# EasyEDA Pro project Main.eprj, board Teensy4.1
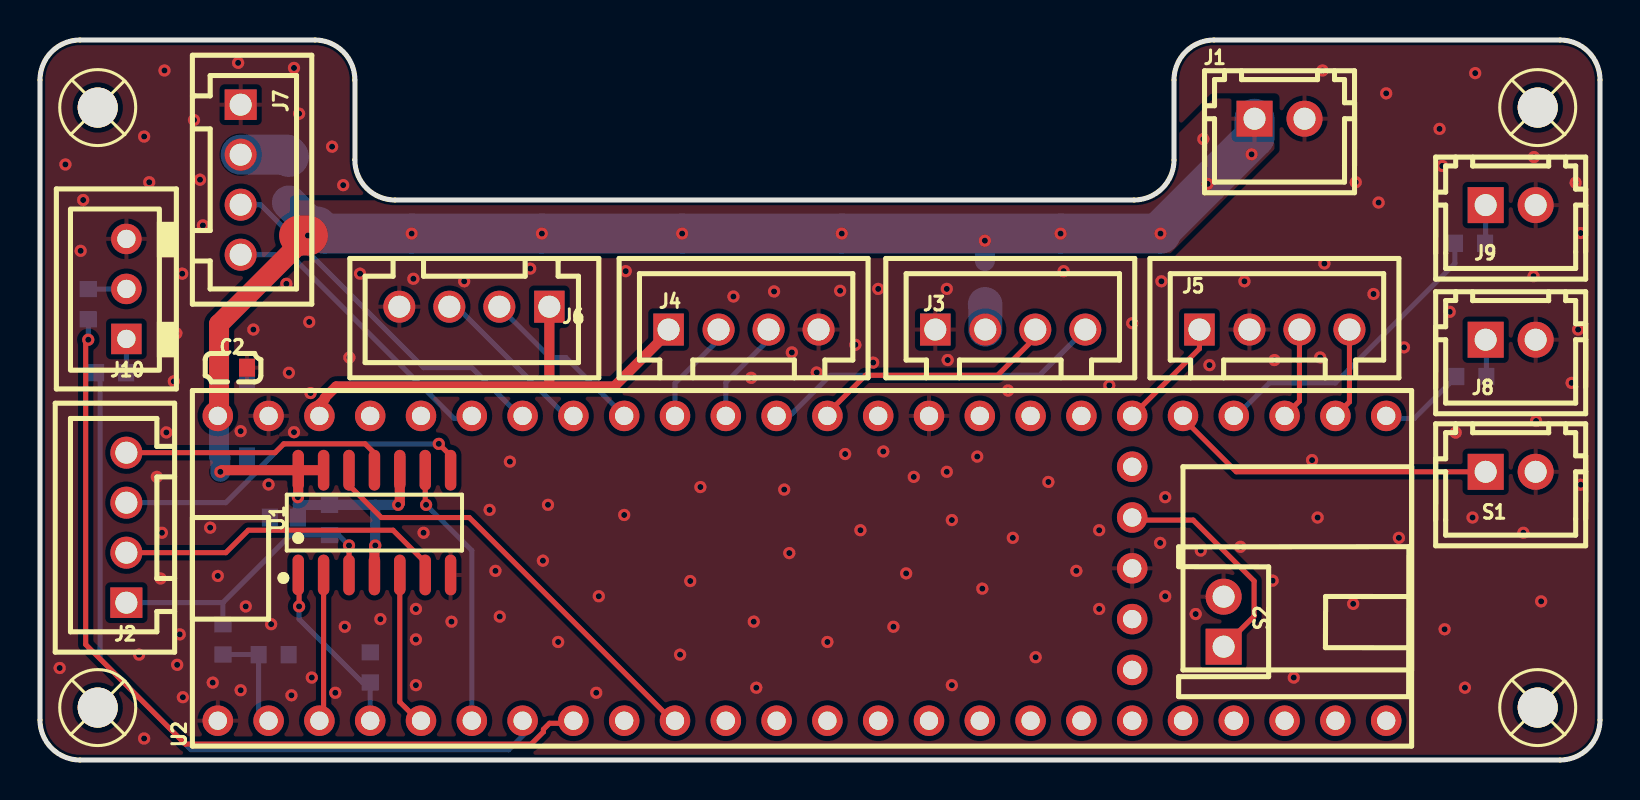
[diagram p9: board, top side]
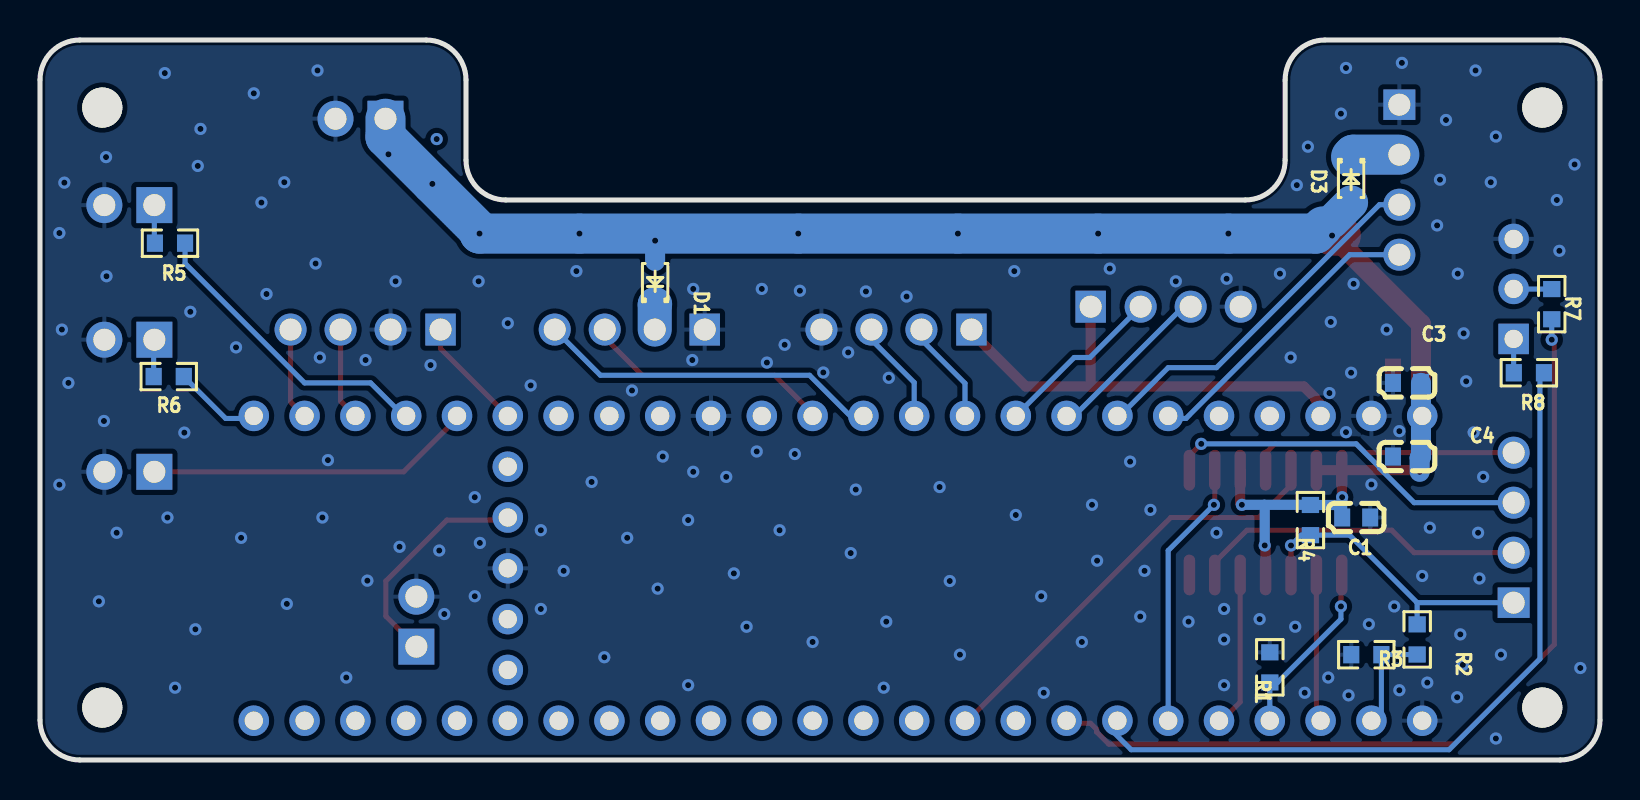
[diagram p10: board, bottom side, seen from below]

Outline 78 x 36 mm; copper layers: Top Layer, Bottom Layer. Coordinates in mm from the lower left corner of the outline.
Outline path: 0,34 0,2 arc(0.59,0.59) 2,0 76,0 arc(77.41,0.59) 78,2 78,34 arc(77.41,35.41) 76,36 58.7,36 arc(57.29,35.41) 56.7,34 56.7,30 arc(56.11,28.59) 54.7,28 17.74,28 arc(16.33,28.59) 15.74,30 15.74,34 arc(15.16,35.41) 13.74,36 2,36 arc(0.59,35.41) 0,34
Stack: Top Layer 0.035mm / Dielectric1 1.51mm FR4 er 4.5 / Bottom Layer 0.035mm

## Design rules (mm)
template: Custom Config
spacing copperThickness1oz (default): track to track 0.102, other pairs 0.152 to 0.3
spacing copperThickness2oz: track to track 0.203, other pairs 0.152 to 0.3
track width copperThickness1oz (default): min 0.127, default 0.254, max 7
track width copperThickness2oz: min 0.203, default 0.254, max 7
differential pair differentialPair (default): width min 0.127, default 0.254, max 2.54; gap min 0.152, default 0.152
via viaSize (default): diameter min 0.5, default 0.61, max 10; hole min 0.3, default 0.305, max 6.3

## Placement (name value [footprint] x y rotation side)
C1  100nF  [C0603]  12.19 12.12 0 bottom
C2  22uF  [C0603]  9.65 19.62 0 top
C3  1uF  [C0603]  9.65 18.86 0 bottom
C4  100nF  [C0603]  9.65 15.17 0 bottom
D1  BAT60B  [SOD-323_L1.7-W1.3-LS2.6-RD-1]  47.24 23.94 90 bottom
D3  BAT60B  [SOD-323_L1.7-W1.3-LS2.6-RD-1]  12.45 29.02 270 bottom
J1  Teensypow  [CONN-TH_2P-P2.50_HX25003-2A]  61.98 32.06 0 top
J2  motSig  [CONN-TH_4P-P2.50_4PIN]  4.32 11.62 90 top
J3  UART3  [CONN-TH_4P-P2.50_4PIN]  48.51 21.52 0 top
J4  I2C0  [CONN-TH_4P-P2.50_4PIN]  35.18 21.52 0 top
J5  UART5 k230  [CONN-TH_4P-P2.50_4PIN]  61.72 21.52 0 top
J6  I2C1  [CONN-TH_4P-P2.50_4PIN]  21.72 22.67 180 top
J7  UART7  [CONN-TH_4P-P2.50_4PIN]  10.03 29.02 270 top
J8  touch0  [CONN-TH_2P-P2.50_HX25003-2A]  73.53 21.01 0 top
J9  touch1  [CONN-TH_2P-P2.50_HX25003-2A]  73.53 27.75 0 top
J10  cnduct  [CONN-TH_3P-P2.50_BX-XH2.54-3PZZ]  4.32 23.55 90 top
R1  10kΩ  [R0603]  16.51 4.63 270 bottom
R2  3.3kΩ  [R0603]  9.14 6.03 90 bottom
R3  4.7kΩ  [R0603]  11.68 5.27 0 bottom
R4  2.2kΩ  [R0603]  14.48 12 90 bottom
R5  1kΩ  [R0603]  71.5 25.84 180 bottom
R6  1kΩ  [R0603]  71.56 19.17 180 bottom
R7  1kΩ  [R0603]  2.41 22.79 270 bottom
R8  1kΩ  [R0603]  3.56 19.36 180 bottom
S1  Start SW  [CONN-TH_2P-P2.50_HX25003-2A]  73.53 14.41 0 top
S2  RST SW  [CONN-TH_2P-P2.50_CNJM_CNJMA2501WR-2P]  59.18 6.92 90 top
SCREW1  -  [Screw-Hole-M2]  2.89 32.62 0 top
SCREW2  -  [Screw-Hole-M2]  2.89 2.62 0 top
SCREW3  -  [Screw-Hole-M2]  74.89 32.62 0 top
SCREW4  -  [Screw-Hole-M2]  74.89 2.62 0 top
U1  CD74HCT126M96  [SOIC-14_L8.7-W3.9-P1.27-LS6.0-BL]  16.72 11.87 0 top
U2  -  [TEENSY 4.1]  39.24 9.58 90 top

## Footprints (pads in the part's own frame, mm; a bottom-side part is the same pattern mirrored in y, then rotated)
C0603
  rect 0.8x0.9 smd: 1(-0.7,0) 2(0.7,0)
CONN-TH_2P-P2.50_CNJM_CNJMA2501WR-2P
  rect 1.8x1.8 hole 1.1: 1(-1.25,0)
  round 1.8 hole 1.1: 2(1.25,0)
CONN-TH_2P-P2.50_HX25003-2A
  rect 1.8x1.8 hole 1.1: 1(-1.25,0)
  round 1.8 hole 1.1: 2(1.25,0)
CONN-TH_3P-P2.50_BX-XH2.54-3PZZ
  rect 1.524x1.524 hole 0.914: 1(-2.5,0)
  round 1.524 hole 0.914: 2(0,0) 3(2.5,0)
CONN-TH_4P-P2.50_4PIN
  rect 1.524x1.6 hole 1.1: 1(-3.75,0)
  round 1.6 hole 1.1: 2(-1.25,0) 3(1.25,0) 4(3.75,0)
R0603
  rect 0.806x0.864 smd: 1(-0.753,0) 2(0.753,0)
Screw-Hole-M2
  round 2 hole 2: 1(0,0)
SOD-323_L1.7-W1.3-LS2.6-RD-1
  rect 0.83x0.63 smd: 1(-1.14,0) 2(1.14,0)
SOIC-14_L8.7-W3.9-P1.27-LS6.0-BL
  oval 0.574x2.038 smd: 1(-3.81,-2.619) 2(-2.54,-2.619) 3(-1.27,-2.619) 4(0,-2.619) 5(1.27,-2.619) 6(2.54,-2.619) 7(3.81,-2.619) 8(3.81,2.619) 9(2.54,2.619) 10(1.27,2.619) 11(0,2.619) 12(-1.27,2.619) 13(-2.54,2.619) 14(-3.81,2.619)
TEENSY 4.1
  round 1.524 hole 0.914: 1(-7.62,30.353) 2(-7.62,27.813) 3(-7.62,25.273) 4(-7.62,22.733) 5(-7.62,20.193) 6(-7.62,17.653) 7(-7.62,15.113) 8(-7.62,12.573) 9(-7.62,10.033) 10(-7.62,7.493) 11(-7.62,4.953) 12(-7.62,2.413) 13(-7.62,-0.127) 14(-7.62,-2.667) 15(-7.62,-5.207) 16(-7.62,-7.747) 17(-7.62,-10.287) 18(-7.62,-12.827) 19(-7.62,-15.367) 20(-7.62,-17.907) 21(-7.62,-20.447) 22(-7.62,-22.987) 23(-7.62,-25.527) 24(-7.62,-28.067) 25(7.62,30.353) 26(7.62,27.813) 27(7.62,25.273) 28(7.62,22.733) 29(7.62,20.193) 30(7.62,17.653) 31(7.62,15.113) 32(7.62,12.573) 33(7.62,10.033) 34(7.62,7.493) 35(7.62,4.953) 36(7.62,2.413) 37(7.62,-0.127) 38(7.62,-2.667) 39(7.62,-5.207) 40(7.62,-7.747) 41(7.62,-10.287) 42(7.62,-12.827) 43(7.62,-15.367) 44(7.62,-17.907) 45(7.62,-20.447) 46(7.62,-22.987) 47(7.62,-25.527) 48(7.62,-28.067) 49(5.08,-15.367) 50(2.54,-15.367) 51(0,-15.367) 52(-2.54,-15.367) 53(-5.08,-15.367)

## Nets
As in the schematic.

Pads without a net: SCREW1 1; SCREW2 1; SCREW3 1; SCREW4 1; U2 9 11 12 13 14 15 18 19 22 23 24 28 29 38 40 41 42 49 52 53

## Via types
v1: diameter 0.61, hole 0.305, Top Layer to Bottom Layer, 169 vias

## Routing (per net, layer and track width the routed paths; a pad name or vN(x,y) marks a point on that pad's centre or on a via; arc(x,y) is an arc through that point)
+3.3V: length 24.1
  Top Layer w0.508: 31.81,21.39 31.43,21.39 28.71,18.68 25.48,18.68 ; 25.48,18.68 25.47,18.69 J6.1 ; 25.48,18.68 14.81,18.68 14.24,18.11 14.24,18.05 13.97,17.78 13.97,17.08
+5V: length 86.8
  Top Layer w0.508: v1(9.02,14.41) 9.1,14.49 U1.14 ; U1.14 12.91,13.16 v1(12.89,13.14) ; U1.14 U1.13 ; U1.10 17.99,12.84 v1(17.91,12.76) ; U1.4 16.72,10.68 v1(16.76,10.73)
  Top Layer w1: 12.95,26.22 12.95,25.8 8.95,21.79 C2.1 8.95,17.14 8.89,17.08
  Top Layer w2: v1(13.4,26.22) 12.96,26.22
  Bottom Layer w0.254: v1(13.4,26.22) 13.4,26.92
  Bottom Layer w0.508: 16.78,12.76 16.76,12.74 v1(16.76,10.73) ; 16.78,12.76 v1(17.91,12.76) ; 16.78,12.76 14.49,12.76 R4.2 12.91,12.75 12.89,12.77 ; 12.89,12.77 v1(12.89,13.14) ; 12.89,12.77 12.89,12.13 C1.2
  Bottom Layer w1: v1(9.02,14.41) 9.02,15.11 C4.1 8.95,17.02 8.89,17.08 8.95,17.14 C3.1 ; 47.24,24.95 v1(47.24,25.97)
  Bottom Layer w1.7: 13.4,26.92 D3.2
  Bottom Layer w2: J1.1 60.73,31.15 v1(58.38,28.81) 56.02,26.45 v1(56.02,26.32) v1(51.03,26.32) v1(40.09,26.32) v1(32.11,26.32) v1(25.09,26.32) v1(18.58,26.32) 14.21,26.32 13.85,26.68
  vias: v1(58.17,31.05) v1(60.58,30.28)
HS45HB-0_SIGNAL: length 18.4
  Top Layer w0.254: U1.8 20.53,15.22 v1(19.94,15.81)
  Bottom Layer w0.254: v1(19.94,15.81) 12.19,15.81 11.03,14.65 11.03,14.61 9.29,12.87 J2.3
HS45HB-1_SIGNAL: length 16.7
  Top Layer w0.254: U1.6 19.26,9.88 17.65,11.49 10.41,11.49 9.29,10.37 J2.2
KRS3301_SIGNAL: length 13.6
  Top Layer w0.254: U1.11 16.72,15.34 16.26,15.81 12.19,15.81 11.75,15.37 J2.4
POWER_GND:
  vias: v1(0.98,4.6) v1(1.27,29.78) v1(2.03,25.46) v1(2.16,28) v1(4.95,5.27) v1(5.21,31.17) v1(5.21,1.08) v1(5.46,28.89) v1(5.84,14.16) v1(6.03,9.08) v1(6.1,11.36) v1(6.22,34.48) v1(6.32,16.38) v1(6.69,18.94) v1(6.82,21.33) v1(6.86,4.76) v1(6.98,6.28) v1(7.11,24.32) v1(7.14,3.14) v1(7.7,32) v1(8,29.02) v1(8.14,26.73) v1(8.51,11.62) v1(8.64,3.87) v1(8.89,9.2) v1(9.91,34.86) v1(10.03,16.44) v1(10.03,3.49) v1(10.29,7.68) v1(10.67,21.52) v1(11.43,13.78) v1(11.56,6.79) v1(12.32,23.81) v1(12.45,19.36) v1(12.57,3.23) v1(12.7,34.6) v1(12.7,16.39) v1(12.95,32.32) v1(13.46,21.9) v1(13.53,18.35) v1(13.59,4.12) v1(14.61,30.67) v1(14.76,3.36) v1(15.16,28.74) v1(15.24,6.66) v1(15.47,20.12) v1(16,24.32) v1(17.02,7.04) v1(18.67,24.06) v1(18.8,7.55) v1(18.8,6.03) v1(18.8,3.74) v1(19.18,11.36) v1(20.57,6.92) v1(21.21,23.94) v1(22.48,12.5) v1(22.77,9.46) v1(22.99,7.17) v1(23.5,14.92) v1(24.51,24.57) v1(25.15,9.97) v1(25.4,12.76) v1(25.91,5.9) v1(27.81,3.36) v1(27.94,8.19) v1(29.21,12.25) v1(29.29,24.44) v1(32,5.27) v1(32.51,8.95) v1(33.02,13.65) v1(34.67,23.17) v1(35.56,19.11) v1(35.69,6.92) v1(35.81,3.61) v1(36.7,23.43) v1(37.21,13.52) v1(37.47,10.35) v1(37.59,20.38) v1(38.84,19.38) v1(39.37,5.9) v1(40,23.46) v1(40.26,15.3) v1(40.77,20.76) v1(41.02,11.49) v1(41.66,19.87) v1(41.91,23.55) v1(42.16,15.43) v1(42.67,6.66) v1(43.31,9.33) v1(43.69,14.16) v1(45.34,23.55) v1(45.34,14.41) v1(45.38,20) v1(45.59,12) v1(45.59,3.74) v1(46.86,15.17) v1(47.12,8.57) v1(48.4,18.47) v1(48.64,11.11) v1(49.78,5.14) v1(50.42,13.9) v1(51.18,24.44) v1(51.82,9.46) v1(52.96,11.49) v1(52.96,7.55) v1(53.47,18.73) v1(54.61,21.84) v1(56.01,10.85) v1(56.07,23.94) v1(56.26,13.14) v1(56.26,8.19) v1(57.78,7.3) v1(58.04,10.47) v1(58.47,19.74) v1(60.02,10.66) v1(60.22,23.94) v1(61.63,8.97) v1(61.72,20) v1(62.69,4.12) v1(63.6,14.99) v1(63.88,12.12) v1(64.01,20.12) v1(64.12,34.48) v1(64.22,24.82) v1(65.66,7.81) v1(65.79,28.89) v1(66.68,23.3) v1(66.93,27.87) v1(67.31,33.33) v1(67.94,11.11) v1(68.2,20.63) v1(69.98,31.56) v1(70.11,29.7) v1(70.23,6.54) v1(70.49,22.41) v1(70.78,16.37) v1(71.25,3.61) v1(71.63,12.12) v1(71.76,34.34) v1(74.17,11.36) v1(74.7,30.14) v1(74.68,24.19) v1(74.8,16.95) v1(75.06,7.93) v1(76.58,18.86) v1(76.78,28.87) v1(76.91,21.52) v1(77.03,26.35) v1(77.03,13.76)
RESET: length 11.3
  Top Layer w0.254: S2.1 60.71,7.19 60.71,8.95 57.66,12 54.61,12
STS3032_SIGNAL: length 15.3
  Top Layer w0.254: U1.3 v1(15.45,10.73)
  Bottom Layer w0.254: 9.14,7.87 9.14,7.86 R2.2 ; 9.14,7.87 12.52,11.24 R4.1 14.93,11.24 v1(15.45,10.73) ; 9.14,7.87 J2.1
TEENSY_2: length 9.1
  Top Layer w0.254: v1(12.95,7.68) 12.95,9.21 U1.1
  Bottom Layer w0.254: 16.51,1.84 R1.2 16.12,3.88 12.95,7.04 v1(12.95,7.68)
TEENSY_3: length 7.9
  Top Layer w0.254: U1.5 17.99,2.9 19.05,1.84
TEENSY_4: length 13.6
  Top Layer w0.254: v1(19.3,12.76) 19.26,12.8 U1.9
  Bottom Layer w0.254: 21.59,1.84 21.59,10.47 v1(19.3,12.76)
TEENSY_5: length 38.6
  Bottom Layer w0.254: R8.2 2.93,19.36 3,19.29 3,5.06 7.55,0.51 23.44,0.51 24.33,1.4 24.33,1.76 24.26,1.84 24.13,1.84
TEENSY_6: length 43.3
  Top Layer w0.254: v1(2.41,21.01) 2.29,20.89 2.29,5.77 7.26,0.8 24.56,0.8 25.17,1.41 25.17,1.53 25.47,1.84 26.67,1.84
  Bottom Layer w0.254: v1(2.41,21.01) R7.2
TEENSY_33: length 4.4
  Bottom Layer w0.254: R6.2 68.72,17.08 67.31,17.08
TEENSY_36: length 15.3
  Bottom Layer w0.254: 59.69,17.08 61.47,18.86 64.77,18.86 70.75,24.83 R5.2
TEENSY_37: length 16.2
  Top Layer w0.254: 57.15,17.08 59.82,14.41 S1.1
TEENSY_K230_ENABLE: length 5.7
  Top Layer w0.254: J5.1 57.97,20.57 U2.43
TEENSY_RX1: length 5.4
  Bottom Layer w0.254: R2.1 10.92,5.27 R3.1 10.93,2.34 11.43,1.84
TEENSY_RX3: length 17.3
  Bottom Layer w0.254: 36.83,17.08 37.36,17.08 39.52,19.24 49.98,19.24 J3.4
TEENSY_RX5: length 14.9
  Bottom Layer w0.254: 21.59,17.08 20.7,17.08 12.51,25.27 J7.4
TEENSY_RX8: length 4.6
  Top Layer w0.254: U2.47 65.47,17.91 J5.4
TEENSY_SCL-0: length 5.2
  Bottom Layer w0.254: U2.35 34.29,18.88 36.81,21.39
TEENSY_SCL-1: length 8.5
  Bottom Layer w0.254: U2.32 26.29,17.2 20.83,22.67 J6.3
TEENSY_SDA-0: length 5.3
  Bottom Layer w0.254: U2.34 31.75,18.83 34.31,21.39
TEENSY_SDA-1: length 8.5
  Bottom Layer w0.254: J6.2 25.51,20.12 26.29,20.12 U2.33
TEENSY_TX1: length 7.5
  Top Layer w0.254: U1.2 14.18,2.05 13.97,1.84
TEENSY_TX2: length 22
  Top Layer w0.254: U1.12 15.45,13.74 17.07,12.12 21.46,12.12 31.75,1.84
TEENSY_TX3: length 12.6
  Top Layer w0.254: 39.37,17.08 39.37,17.33 41.28,19.24 47.88,19.24 49.76,21.12 J3.3
TEENSY_TX5: length 18.5
  Bottom Layer w0.254: 24.13,17.08 21.59,19.62 19.18,19.62 11.03,27.77 J7.3
TEENSY_TX8: length 4.6
  Top Layer w0.254: U2.46 62.97,17.95 J5.3
$1N12604: length 1.7
  Bottom Layer w0.254: R8.1 4.32,19.37 J10.1
$1N12618: length 1.9
  Bottom Layer w0.254: J8.1 72.32,20.98 R6.1
$1N12632: length 1.9
  Bottom Layer w0.254: R7.1 4.31,23.55 J10.2
$1N12638: length 1.9
  Bottom Layer w0.254: R5.1 72.28,25.87 J9.1
$1N65243: length 1.3
  Bottom Layer w1.7: D1.1 47.26,22.78 J3.2
$1N78123: length 2.5
  Bottom Layer w2: J7.2 12.34,30.27 D3.1

## Copper pours and planes (outline as drawn; the poured copper is in the pictures)
+5V on Top Layer: 58.67,33.08 55.5,29.9 55.5,25.33 56.51,25.33 61.72,30.54 61.72,33.08
+5V on Top Layer: 12.75,27.98 55.63,27.98 55.63,25.35 12.75,25.35
POWER_GND on Top Layer: -1.4,39.3 80.77,39.3 80.77,-4.13 -1.4,-4.13
POWER_GND on Bottom Layer: -5.72,44.13 79.76,44.13 79.76,-11.75 -5.72,-11.75
